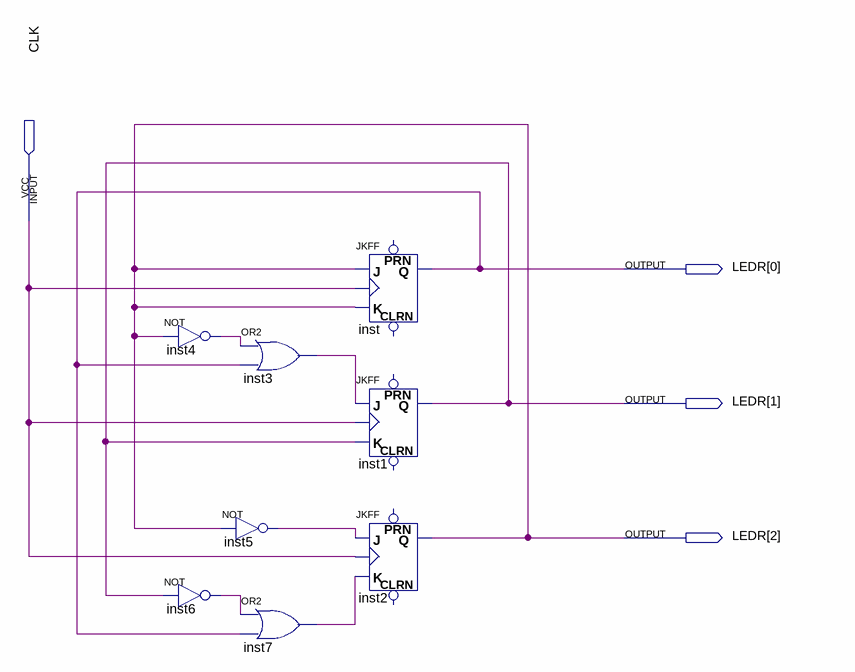
[diagram p0: schematic sheet]
// Quartus schematic lab2.bdf as structural Verilog: 8 symbols, 4 pins
module lab2 (
  input  CLK,
  output [2:0] LEDR
);

  wire inst3_out, inst4_out, inst5_out, inst6_out, inst7_out;

  not inst4 (inst4_out, LEDR[2]);
  not inst5 (inst5_out, LEDR[2]);
  not inst6 (inst6_out, LEDR[1]);
  or inst3 (inst3_out, inst4_out, LEDR[0]);
  or inst7 (inst7_out, inst6_out, LEDR[0]);
  JKFF inst (.K(LEDR[2]), .J(LEDR[2]), .CLK(CLK), .Q(LEDR[0]));  // open: PRN, CLRN
  JKFF inst1 (.K(LEDR[1]), .J(inst3_out), .CLK(CLK), .Q(LEDR[1]));  // open: PRN, CLRN
  JKFF inst2 (.K(inst7_out), .J(inst5_out), .CLK(CLK), .Q(LEDR[2]));  // open: PRN, CLRN
endmodule
